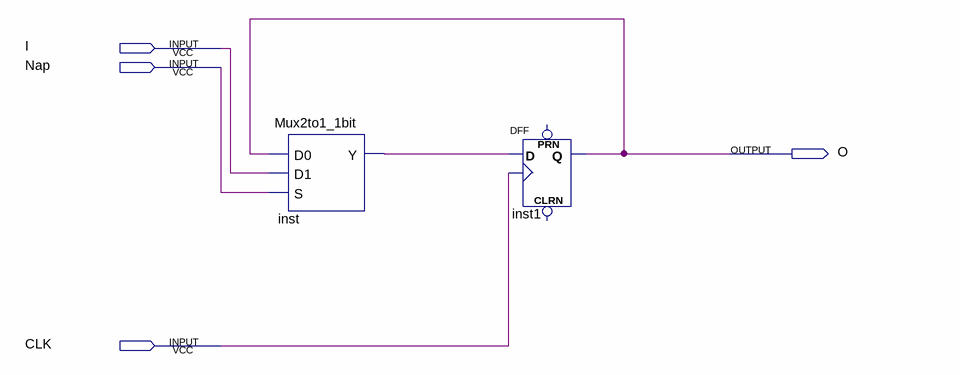
[diagram p0: schematic sheet]
// Quartus schematic Register1bit.bdf as structural Verilog: 2 symbols, 4 pins
module Register1bit (
  input  I,
  input  Nap,
  input  CLK,
  output O
);

  wire inst_y;

  Mux2to1_1bit inst (.D0(O), .D1(I), .S(Nap), .Y(inst_y));
  DFF inst1 (.CLK(CLK), .D(inst_y), .Q(O));  // open: CLRN, PRN
endmodule
